# Altium schematic sheet Power_tree.SchDoc
size A4; SheetNumber: 2; SheetTotal: 6
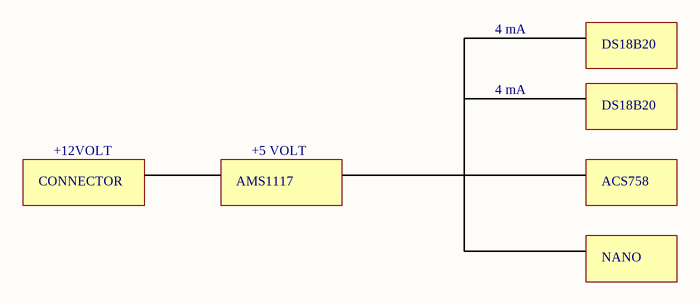
[diagram p0: Power_tree.SchDoc]

## Notes on the sheet
- 4 mA
- DS18B20
- CONNECTOR
- +12VOLT
- AMS1117
- +5 VOLT
- ACS758
- NANO